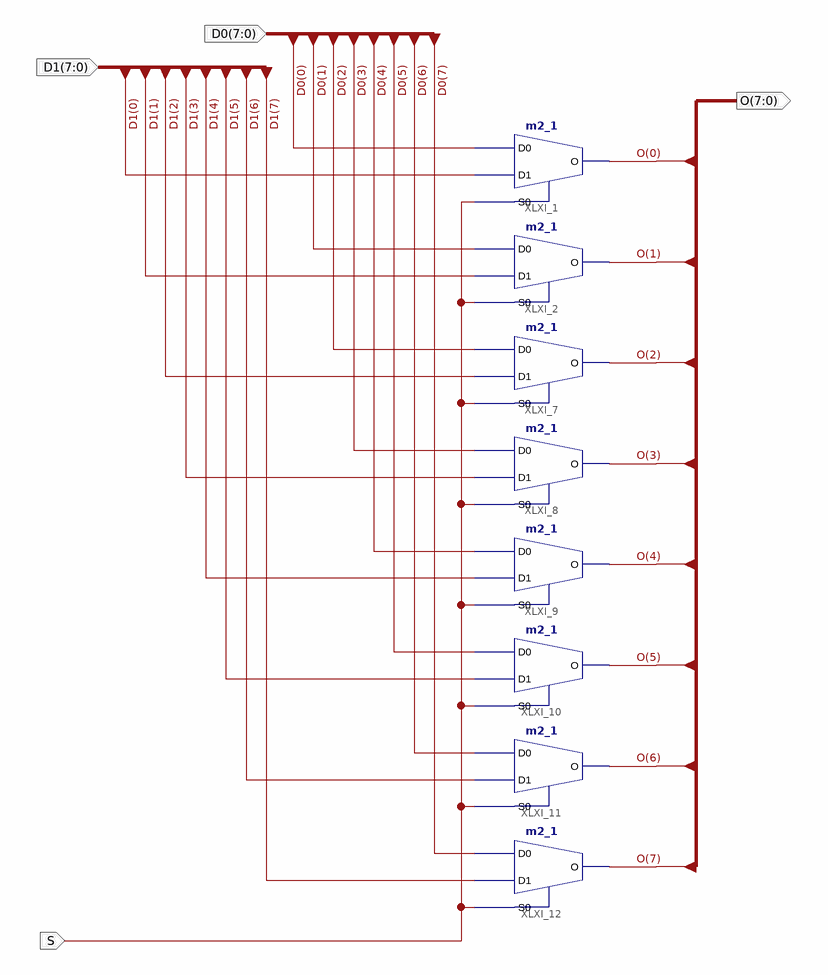
[diagram p0: schematic sheet 1]
// Xilinx ISE schematic mux2x1x8.sch (spartan6) as structural Verilog: 8 symbols, 4 ports
module mux2x1x8 (
  input  [7:0] D1,
  input  [7:0] D0,
  input  S,
  output [7:0] O
);

  m2_1 XLXI_1 (.D0(D0[0]), .D1(D1[0]), .S0(S), .O(O[0]));
  m2_1 XLXI_2 (.D0(D0[1]), .D1(D1[1]), .S0(S), .O(O[1]));
  m2_1 XLXI_7 (.D0(D0[2]), .D1(D1[2]), .S0(S), .O(O[2]));
  m2_1 XLXI_8 (.D0(D0[3]), .D1(D1[3]), .S0(S), .O(O[3]));
  m2_1 XLXI_9 (.D0(D0[4]), .D1(D1[4]), .S0(S), .O(O[4]));
  m2_1 XLXI_10 (.D0(D0[5]), .D1(D1[5]), .S0(S), .O(O[5]));
  m2_1 XLXI_11 (.D0(D0[6]), .D1(D1[6]), .S0(S), .O(O[6]));
  m2_1 XLXI_12 (.D0(D0[7]), .D1(D1[7]), .S0(S), .O(O[7]));
endmodule
